# Altium project The_Robot.PrjPcb (part 2 of 2)

## Sheet Microcontroller.SchDoc
size A4; SheetNumber: 4; SheetTotal: 6
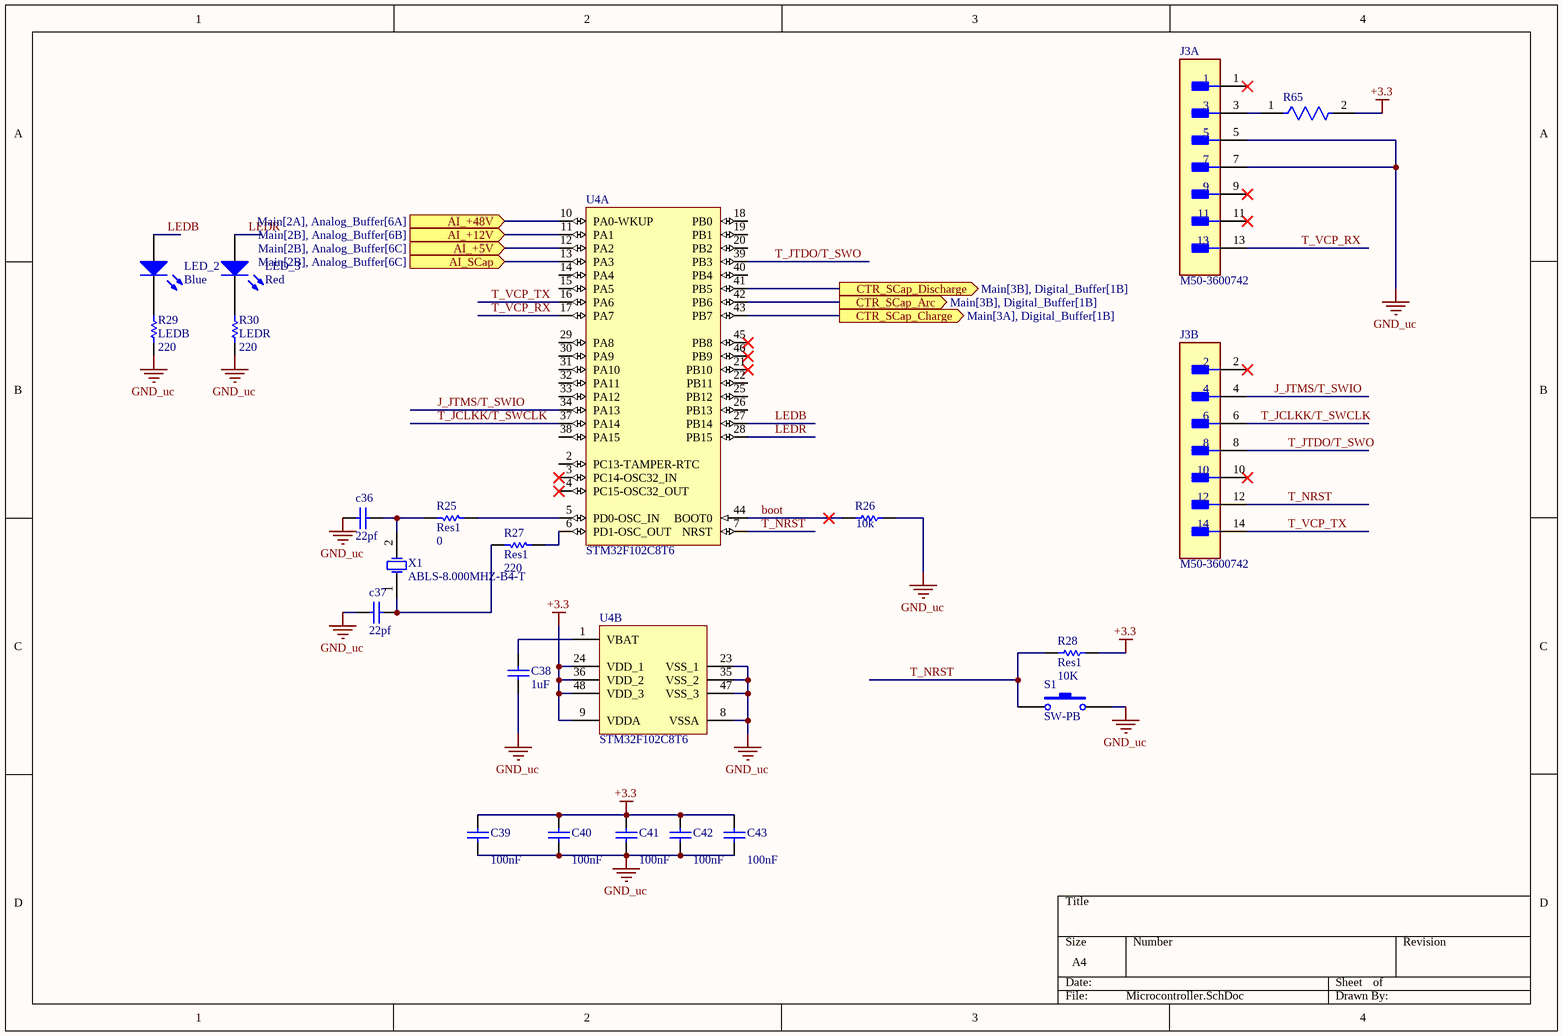
[diagram p3: Microcontroller.SchDoc]

### Parts
c36  22pf  [0805C]
c37  22pf  [0805C]
C38  1uF  [0805C]
C39  value 100nF  [0805C]
C40  value 100nF  [0805C]
C41  value 100nF  [0805C]
C42  value 100nF  [0805C]
C43  value 100nF  [0805C]
J3  M50-3600742  [FP-M50-3600742-MFG]  (parts A,B of 2)
LED_2  Blue  [0805LED]
LED_3  Red  [0805LED]
R25  Res1  value 0  [0805L]
R26  value 10k  [0805L]  (hidden comment: Res1)
R27  Res1  value 220  [0805L]
R28  Res1  value 10K  [0805L]
R29  LEDB  value 220  [0805L]
R30  LEDR  value 220  [0805L]
R65  RC1206JR-070RL  [FP-RC1206-MFG]  (value not drawn)
S1  SW-PB  [sw-pb-4p]
U4  STM32F102C8T6  [STM-LQFP48_N]  (parts A,B of 2)
X1  ABLS-8.000MHZ-B4-T  [ABRA-ABLS-14.7456MHZ-B2-T_V]

### Ports
AI_+5V (in, see Main[2B], Analog_Buffer[6C]), AI_+12V (in, see Main[2B], Analog_Buffer[6B]), AI_+48V (in, see Main[2A], Analog_Buffer[6A]), AI_SCap (in, see Main[2B], Analog_Buffer[6C]), CTR_SCap_Arc (out, see Main[3B], Digital_Buffer[1B]), CTR_SCap_Charge (out, see Main[3A], Digital_Buffer[1B]), CTR_SCap_Discharge (out, see Main[3B], Digital_Buffer[1B])

### Nets
+3.3: C39.2 C40.2 C41.2 C42.2 C43.2 R28.1 R65.2 U4.9(VDDA) U4.24(VDD_1) U4.36(VDD_2) U4.48(VDD_3)
GND_uc: c36.2 c37.2 C38.1 C39.1 C40.1 C41.1 C42.1 C43.1 J3.5 J3.7 R26.2 R29.2 R30.1 S1.2 U4.8(VSSA) U4.23(VSS_1) U4.35(VSS_2) U4.47(VSS_3)
AI_+5V: U4.12(PA2) ; port AI_+5V
AI_+12V: U4.11(PA1) ; port AI_+12V
AI_+48V: U4.10(PA0-WKUP) ; port AI_+48V
AI_SCap: U4.13(PA3) ; port AI_SCap
boot: R26.1 U4.44(BOOT0)
CTR_SCap_Arc: U4.42(PB6) ; port CTR_SCap_Arc
CTR_SCap_Charge: U4.43(PB7) ; port CTR_SCap_Charge
CTR_SCap_Discharge: U4.41(PB5) ; port CTR_SCap_Discharge
J_JTMS/T_SWIO: J3.4 U4.34(PA13)
LEDB: LED_2.1(A) U4.27(PB14)
LEDR: LED_3.1(A) U4.28(PB15)
T_JCLKK/T_SWCLK: J3.6 U4.37(PA14)
T_JTDO/T_SWO: J3.8 U4.39(PB3)
T_NRST: J3.12 R28.2 S1.1 U4.7(NRST)
T_VCP_RX: J3.13 U4.17(PA7)
T_VCP_TX: J3.14 U4.16(PA6)
Netc36_1: c36.1 R25.2 X1.2(X2)
Netc37_1: c37.1 R27.1 X1.1(X1)
NetC38_2: C38.2 U4.1(VBAT)
NetJ3_3: J3.3 R65.1
NetLED_2_2: LED_2.2(K) R29.1
NetLED_3_2: LED_3.2(K) R30.2
NetR25_1: R25.1 U4.5(PD0-OSC_IN)
NetR27_2: R27.2 U4.6(PD1-OSC_OUT)

Not connected (* = marked no-connect by the designer): J3 1* 2* 9* 10* 11*; U4 2(PC13-TAMPER-RTC) 3(PC14-OSC32_IN)* 4(PC15-OSC32_OUT)* 14(PA4) 15(PA5) 18(PB0) 19(PB1) 20(PB2) 21(PB10)* 22(PB11) 25(PB12) 26(PB13) 29(PA8) 30(PA9) 31(PA10) 32(PA11) 33(PA12) 38(PA15) 40(PB4) 45(PB8)* 46(PB9)*

### Library data of the parts
c36 c37 C38 = Cap_UP: Capacitor; Published: 8-Jun-2000; LatestRevisionDate: 17-Jul-2002; LatestRevisionNote: Re-released for DXP Platform.; PackageReference: RAD-0.3; Publisher: Altium Limited
  c36 c37: Value: 22pf
  C38: Value: 1uF
C39-C43 = Cap: Capacitor; Manufacturer: Generic Components; Class: Passive; Published: 08/06/2000; Publisher: Altium Hobart Technology Centre; SubClass: Capacitor
J3 = CMP-15831-000067-1: CONN HEADER SMD 14POS 1.27MM; Row Spacing: 0.05inch; Number of Contacts: 14; Contact Resistance: 30mR; Gender: Male; Max Current Rating: 1A; Radiation Hardening: No; Series: Archer M50; Package Quantity: 500; Length: 8.89mm; Orientation: Straight; Number of Positions: 14; Termination: Solder; Housing Material: Thermoplastic; Depth: 3.41mm; Pitch: 1.27mm; Packaging: Bulk; Contact Plating: Gold; Contact Mating Length: 0.118inch; Max Operating Temperature: 105°C; Number of Rows: 2; Min Operating Temperature: -40°C; Color: Black; Mount: Surface Mount; Contact Material: Copper Alloy
LED_2 LED_3 = LED3: Typical BLUE SiC LED; Published: 8-Jun-2000; LatestRevisionDate: 17-Dec-2003; LatestRevisionNote: PCB Footprint replaced.; DatasheetDocument: 16-Apr-2002; PackageDocument: 16-Apr-2002; PackageReference: 3.5X2.8X1.9; Publisher: Altium Limited
R25-R30 = Res1: Resistor; Published: 8-Jun-2000; LatestRevisionDate: 17-Jul-2002; LatestRevisionNote: Re-released for DXP Platform.; PackageReference: AXIAL-0.3; Publisher: Altium Limited
R65 = CMP-2100-03681-2: RES SMD 0 OHM JUMPER 1/4W 1206; Manufacturer: YAGEO; Voltage Rating: 200V; Temperature Coefficient: 300ppm/°C; Power Rating: 0.25W; Value: 0Ω; Tolerance: 5%; Manufacturer Part Number: RC1206JR-070RL; Temperature Range Low: -55°C; Category: Res; Automotive: No; Ipc Land Pattern Name: RESC310160X55; Device Class L1: Passive Components; Temperature: -55°C to +155°C; ComponentLink2URL: https://www.yageo.com/upload/media/product/productsearch/datasheet/rchip/PYu-RC_Group_51_RoHS_L_10.pdf; Lead Free: Yes; Height: 0.65mm; Footprint Url: https://www.yageo.com/upload/website/yageo_PYu-R_Mount_10_19050818_343.pdf; Package: RC1206; Digikey Description: RES SMD 0 OHM JUMPER 1/4W 1206; Temperature Range High: +155°C; Device Class L3: Chip SMD Resistors; Device Class L2: Resistors; Octopart: https://octopart.com/rc1206jr-070rl-yageo-40025601; Resistance: 0Ω; Series: RC; ComponentLink2Description: Datasheet; Composition: Thick Film; RoHS: TRUE; Mouser Description: Resistor: thick film; SMD; 1206; 0O; 0.25W; ±5%; -55÷155°C
S1 = SW-PB: Switch; Published: 24-Mar-1999; LatestRevisionDate: 17-Jul-2002; LatestRevisionNote: Re-released for DXP Platform.; PackageReference: SPST-2; Publisher: Altium Limited
U4 = STM32F102C8T6: ARM Cortex-M3 32-bit MCU, 64 KB Flash, 10 KB Internal RAM, 37 I/Os, 48-pin LQFP, -40 to 85 degC, Tray; A/D Converter: 1x12-bit (10 Channel); FLASH Size (Prog) (kB): 64; I/Os (High Current): 37; Internal RAM Size (kB): 10; Operating Frequency(F) (Processor speed) (MHz): 48; Supply Voltage(Vcc) min (V): 2; DatasheetVersion: Rev. 5; PackageVersion: Rev. 6, 06/2013; PackageReference: LQFP48; PackageDescription: 48-Pin Low Profile Quad Flat Package, 7 x 7 mm Body, 0.5 mm Pitch; Supplier 1: Digi-Key; Supplier Part Number 1: 497-8307-ND; Supplier 2: Farnell; Supplier Part Number 2: 2333153; Supplier 3: Newark; Supplier Part Number 3: 99W9777; Supplier 4: Mouser; Supplier Part Number 4: 511-STM32F102C8T6; Core: ARM Cortex-M3; Packing: Tray; Mounting Technology: Surface Mount; PartNumber: STM32F102C8T6; ComponentLink1Description: Manufacturer URL; ComponentLink1URL: http://www.st.com/web/en/home.html; ComponentLink2Description: Datasheet; ComponentLink2URL: http://www.st.com/st-web-ui/static/active/en/resource/technical/document/datasheet/CD00210831.pdf; ComponentLink3Description: Package Specification; ComponentLink3URL: http://www.st.com/st-web-ui/static/active/en/resource/technical/document/datasheet/DM00058181.pdf
X1 = CMP-2000-05726-1: Low Profile Crystal, 8.0 MHz, +/- 30 ppm, -20 to 70 degC, 2-Pin SMD, RoHS, Tape and Reel; Brand: ABRACON; Case Length: 11.4mm; Frequency Stability: 50PPM; ESR: 80Ohms; Case Height: 4.2mm; Tolerance: 30PPM; Frequency: 8MHz; Case Width: 4.7mm; Load Capacitance: 18pF; Datasheet Version: 04/2011; Termination Style: SMD/SMT; Dimensions: 4.7mmWx11.4mmLx4.2mmH; Packaging: Reel; Manufacturer: ABRACON; Package URL: http://www.abracon.com/Support/PackageDrawing/Resonators/ABLS-2D.pdf; Mounting Technology: SurfaceMount; Package Reference: ABLS-14.7456MHZ-B2-T; Product Category: Crystals; Package Description: 2-Pin Surface Mount Device, Body 11.4 x 4.7 mm; Package / Case: HC-49/US; Mounting Style: SMD/SMT; Operating Temperature Range: -20Cto+70C; Series: ABLS; Factory Pack Quantity: 1000; Datasheet URL: http://www.abracon.com/Resonators/abls.pdf; Manufacturer URL: http://www.abracon.com/; RoHS: Details; Type: LowProfileMicroprocessorCrystal

## Sheet Digital_Buffer.SchDoc
size A4; SheetNumber: 5; SheetTotal: 6
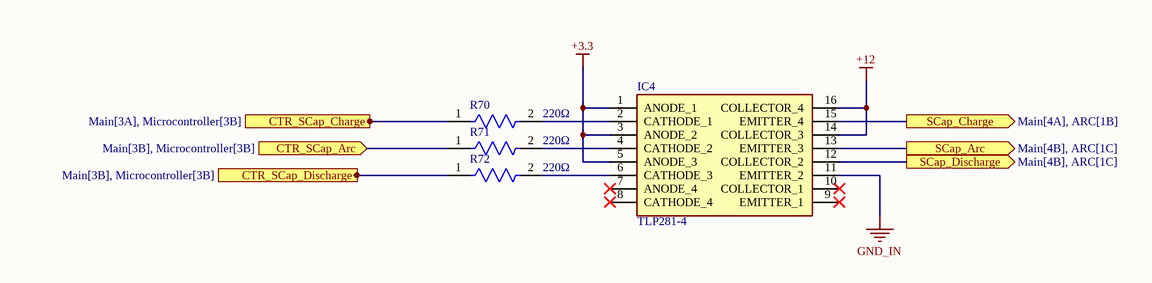
[diagram p4: Digital_Buffer.SchDoc]

### Parts
IC4  TLP281-4  [SOIC127P700X210-16N]
R70  value 220Ω  [FP-RT1206-MFG]  (hidden comment: RT1206FRE07220RL)
R71  value 220Ω  [FP-RT1206-MFG]  (hidden comment: RT1206FRE07220RL)
R72  value 220Ω  [FP-RT1206-MFG]  (hidden comment: RT1206FRE07220RL)

### Ports
CTR_SCap_Arc (in, see Main[3B], Microcontroller[3B]), CTR_SCap_Charge (in, see Main[3A], Microcontroller[3B]), CTR_SCap_Discharge (in, see Main[3B], Microcontroller[3B]), SCap_Arc (out, see Main[4B], ARC[1C]), SCap_Charge (out, see Main[4A], ARC[1B]), SCap_Discharge (out, see Main[4B], ARC[1C])

### Nets
+3.3: IC4.1(ANODE_1) IC4.3(ANODE_2) IC4.5(ANODE_3)
+12: IC4.14(COLLECTOR_3) IC4.16(COLLECTOR_4)
GND_IN: IC4.11(EMITTER_2)
CTR_SCap_Arc: R71.1 ; port CTR_SCap_Arc
CTR_SCap_Charge: R70.1 ; port CTR_SCap_Charge
CTR_SCap_Discharge: R72.1 ; port CTR_SCap_Discharge
SCap_Arc: IC4.13(EMITTER_3) ; port SCap_Arc
SCap_Charge: IC4.15(EMITTER_4) ; port SCap_Charge
SCap_Discharge: IC4.12(COLLECTOR_2) ; port SCap_Discharge
NetIC4_2: IC4.2(CATHODE_1) R70.2
NetIC4_4: IC4.4(CATHODE_2) R71.2
NetIC4_6: IC4.6(CATHODE_3) R72.2

Not connected (* = marked no-connect by the designer): IC4 7(ANODE_4)* 8(CATHODE_4)* 9(EMITTER_1)* 10(COLLECTOR_1)*

### Library data of the parts
IC4 = TLP281-4: Integrated Circuit; Manufacturer_Name: Toshiba; Datasheet Link: https://www.datasheet5.com/part/TLP281-4/Toshiba%20America%20Electronic%20Components/ecad-model; Height: 2.1mm; Manufacturer_Part_Number: TLP281-4; Mouser Part Number: 757-TLP281-4; Mouser Price/Stock: https://www.mouser.co.uk/ProductDetail/Toshiba/TLP281-4?qs=nul2o59pkPL9bOIg9yeNdw%3D%3D
R70-R72 = CMP-03412-012208-1: RES SMD 220 OHM 1% 1/4W 1206; Manufacturer: Yageo; Power Rating: 0.25W; Tolerance: 0.0002; Temperature Coefficient: 50 ppm/°C; Voltage Rating: 200V; RoHS: TRUE; Device Class L2: Resistors; Composition: Thin Film; Mouser Description: Res Thin Film 1206 220 Ohm 1% 0.25W(1/4W) ±50ppm/C Epoxy Pad SMD T/R; Manufacturer Part Number: RT1206FRE07220RL; Package: RT1206; Automotive: No; Category: Res; Temperature Range High: +155°C; Temperature Range Low: -55°C; Footprint Url: http://www.yageo.com/exep/pages/download/literatures/PYu-R_Mount_10.pdf; Series: RT; Height: 0.65mm; Digikey Description: RES SMD 220 OHM 1% 1/4W 1206; Temperature: -55°C to +155°C; Lead Free: Yes; ComponentLink2Description: Datasheet; Device Class L1: Passive Components; Device Class L3: Chip SMD Resistors; ComponentLink2URL: http://www.yageo.com/documents/recent/PYu-RT_1-to-0.01_RoHS_L_9.pdf; Ipc Land Pattern Name: RESC310160X55; Resistance: 220Ω; Octopart: https://octopart.com/rt1206fre07220rl-yageo-1236006

## Sheet Analog_Buffer.SchDoc
size A2; SheetNumber: 6; SheetTotal: 6
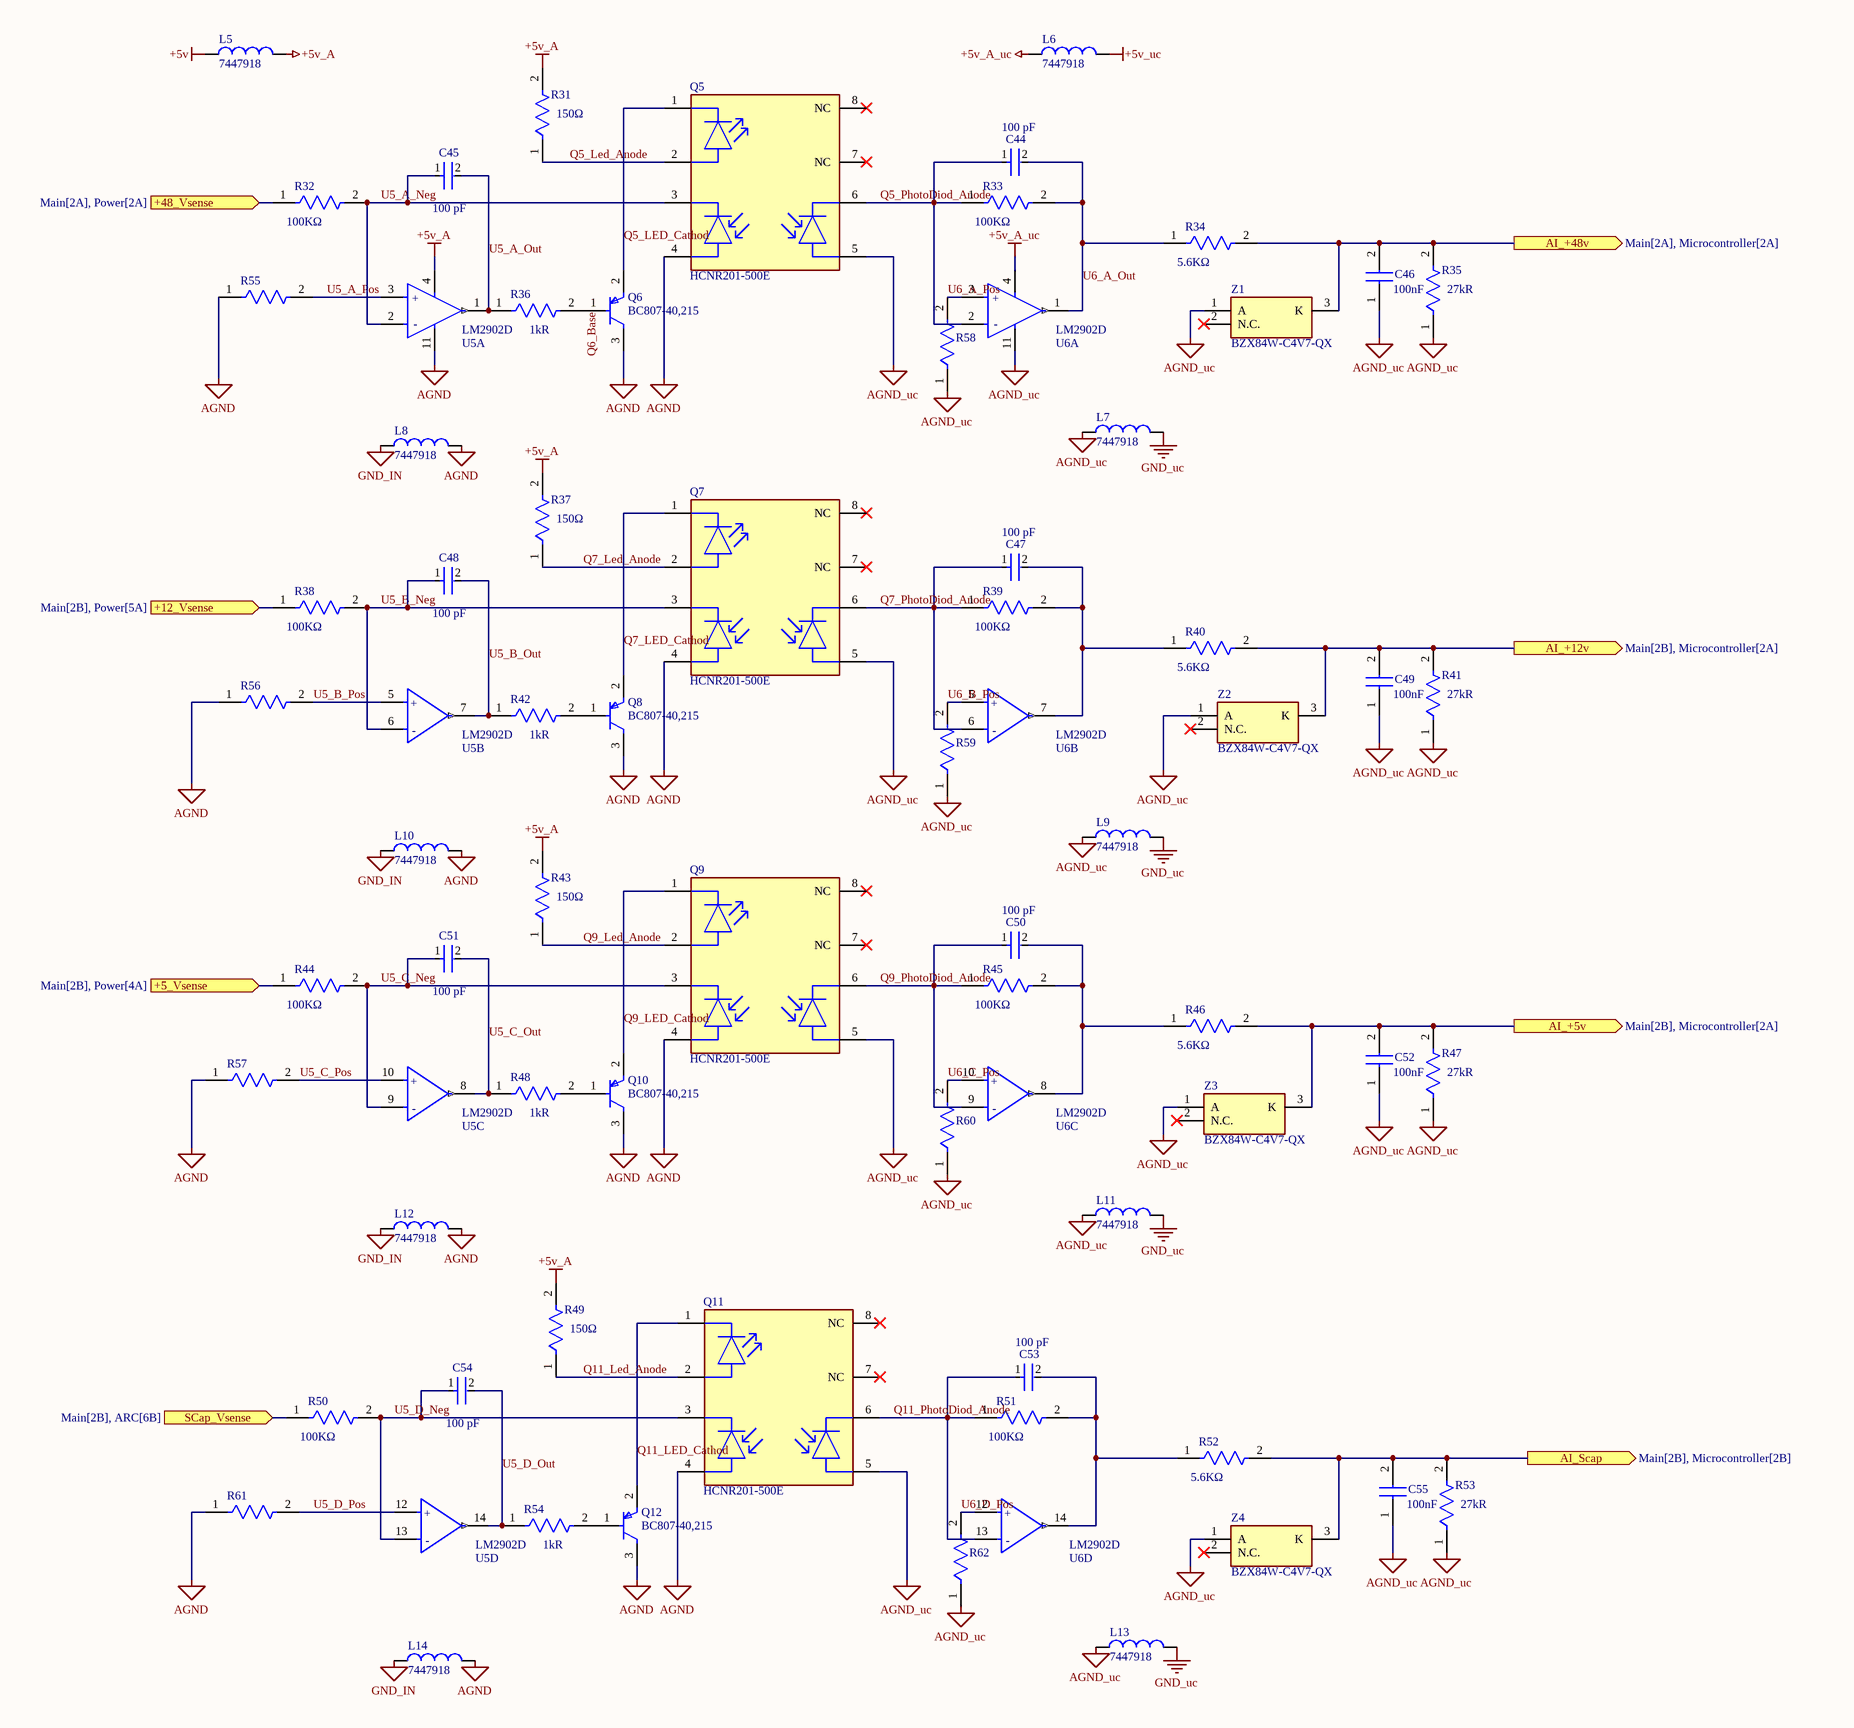
[diagram p5: Analog_Buffer.SchDoc]

### Parts
C44  value 100 pF  [FP-C1206C-EB-MFG]  (hidden comment: C1206C101K5GACTU)
C45  value 100 pF  [FP-C1206C-EB-MFG]  (hidden comment: C1206C101K5GACTU)
C46  100nF  [CAPC3216X95N]
C47  value 100 pF  [FP-C1206C-EB-MFG]  (hidden comment: C1206C101K5GACTU)
C48  value 100 pF  [FP-C1206C-EB-MFG]  (hidden comment: C1206C101K5GACTU)
C49  100nF  [CAPC3216X95N]
C50  value 100 pF  [FP-C1206C-EB-MFG]  (hidden comment: C1206C101K5GACTU)
C51  value 100 pF  [FP-C1206C-EB-MFG]  (hidden comment: C1206C101K5GACTU)
C52  100nF  [CAPC3216X95N]
C53  value 100 pF  [FP-C1206C-EB-MFG]  (hidden comment: C1206C101K5GACTU)
C54  value 100 pF  [FP-C1206C-EB-MFG]  (hidden comment: C1206C101K5GACTU)
C55  100nF  [CAPC3216X95N]
L5  7447918  [WE-MI_1206_L3.2W1.6H1.1]
L6  7447918  [WE-MI_1206_L3.2W1.6H1.1]
L7  7447918  [WE-MI_1206_L3.2W1.6H1.1]
L8  7447918  [WE-MI_1206_L3.2W1.6H1.1]
L9  7447918  [WE-MI_1206_L3.2W1.6H1.1]
L10  7447918  [WE-MI_1206_L3.2W1.6H1.1]
L11  7447918  [WE-MI_1206_L3.2W1.6H1.1]
L12  7447918  [WE-MI_1206_L3.2W1.6H1.1]
L13  7447918  [WE-MI_1206_L3.2W1.6H1.1]
L14  7447918  [WE-MI_1206_L3.2W1.6H1.1]
Q5  HCNR201-500E  [FP-HCNR201-500E-MFG]
Q6  BC807-40,215  [FP-SOT23-IPC_B]
Q7  HCNR201-500E  [FP-HCNR201-500E-MFG]
Q8  BC807-40,215  [FP-SOT23-IPC_B]
Q9  HCNR201-500E  [FP-HCNR201-500E-MFG]
Q10  BC807-40,215  [FP-SOT23-IPC_B]
Q11  HCNR201-500E  [FP-HCNR201-500E-MFG]
Q12  BC807-40,215  [FP-SOT23-IPC_B]
R31  Resistance: 150Ω  [FP-RP732B-MFG]  (hidden comment: RP73D2B150RBTG)
R32  value 100KΩ  [FP-RT1206-MFG]  (hidden comment: RT1206DRE07100KL)
R33  value 100KΩ  [FP-RT1206-MFG]  (hidden comment: RT1206DRE07100KL)
R34  value 5.6KΩ  [FP-CRGP1206-IPC_C]  (hidden comment: CRGP1206F5K6)
R35  Resistance: 27kR  [FP-RC3216-IPC_A]  (hidden comment: RC3216J273CS)
R36  Resistance: 1kR  [FP-CR1206-IPC_A]  (hidden comment: CR1206-FX-1001ELF)
R37  Resistance: 150Ω  [FP-RP732B-MFG]  (hidden comment: RP73D2B150RBTG)
R38  value 100KΩ  [FP-RT1206-MFG]  (hidden comment: RT1206DRE07100KL)
R39  value 100KΩ  [FP-RT1206-MFG]  (hidden comment: RT1206DRE07100KL)
R40  value 5.6KΩ  [FP-CRGP1206-IPC_C]  (hidden comment: CRGP1206F5K6)
R41  Resistance: 27kR  [FP-RC3216-IPC_A]  (hidden comment: RC3216J273CS)
R42  Resistance: 1kR  [FP-CR1206-IPC_A]  (hidden comment: CR1206-FX-1001ELF)
R43  Resistance: 150Ω  [FP-RP732B-MFG]  (hidden comment: RP73D2B150RBTG)
R44  value 100KΩ  [FP-RT1206-MFG]  (hidden comment: RT1206DRE07100KL)
R45  value 100KΩ  [FP-RT1206-MFG]  (hidden comment: RT1206DRE07100KL)
R46  value 5.6KΩ  [FP-CRGP1206-IPC_C]  (hidden comment: CRGP1206F5K6)
R47  Resistance: 27kR  [FP-RC3216-IPC_A]  (hidden comment: RC3216J273CS)
R48  Resistance: 1kR  [FP-CR1206-IPC_A]  (hidden comment: CR1206-FX-1001ELF)
R49  Resistance: 150Ω  [FP-RP732B-MFG]  (hidden comment: RP73D2B150RBTG)
R50  value 100KΩ  [FP-RT1206-MFG]  (hidden comment: RT1206DRE07100KL)
R51  value 100KΩ  [FP-RT1206-MFG]  (hidden comment: RT1206DRE07100KL)
R52  value 5.6KΩ  [FP-CRGP1206-IPC_C]  (hidden comment: CRGP1206F5K6)
R53  Resistance: 27kR  [FP-RC3216-IPC_A]  (hidden comment: RC3216J273CS)
R54  Resistance: 1kR  [FP-CR1206-IPC_A]  (hidden comment: CR1206-FX-1001ELF)
R55  RC1206JR-070RL  [FP-RC1206-MFG]  (value not drawn)
R56  RC1206JR-070RL  [FP-RC1206-MFG]  (value not drawn)
R57  RC1206JR-070RL  [FP-RC1206-MFG]  (value not drawn)
R58  RC1206JR-070RL  [FP-RC1206-MFG]  (value not drawn)
R59  RC1206JR-070RL  [FP-RC1206-MFG]  (value not drawn)
R60  RC1206JR-070RL  [FP-RC1206-MFG]  (value not drawn)
R61  RC1206JR-070RL  [FP-RC1206-MFG]  (value not drawn)
R62  RC1206JR-070RL  [FP-RC1206-MFG]  (value not drawn)
U5  LM2902D  [FP-D0014A-MFG]  (parts A,B,C,D of 4)
U6  LM2902D  [FP-D0014A-MFG]  (parts A,B,C,D of 4)
Z1  BZX84W-C4V7-QX  [SOT65P210X110-3N]
Z2  BZX84W-C4V7-QX  [SOT65P210X110-3N]
Z3  BZX84W-C4V7-QX  [SOT65P210X110-3N]
Z4  BZX84W-C4V7-QX  [SOT65P210X110-3N]

### Ports
+5_Vsense (in, see Main[2B], Power[4A]), +12_Vsense (in, see Main[2B], Power[5A]), +48_Vsense (in, see Main[2A], Power[2A]), AI_+5v (out, see Main[2B], Microcontroller[2A]), AI_+12v (out, see Main[2B], Microcontroller[2A]), AI_+48v (out, see Main[2A], Microcontroller[2A]), AI_Scap (out, see Main[2B], Microcontroller[2B]), SCap_Vsense (in, see Main[2B], ARC[6B])

### Nets
+5v: L5.1
+5v_A: L5.2 R31.2 R37.2 R43.2 R49.2 U5.4(VCC)
+5v_A_uc: L6.1 U6.4(VCC)
+5v_uc: L6.2
AGND: L8.2 L10.2 L12.2 L14.2 Q5.4(PD1_ANODE) Q6.3(C) Q7.4(PD1_ANODE) Q8.3(C) Q9.4(PD1_ANODE) Q10.3(C) Q11.4(PD1_ANODE) Q12.3(C) R55.1 R56.1 R57.1 R61.1 U5.11(GND)
AGND_uc: C46.1 C49.1 C52.1 C55.1 L7.1 L9.1 L11.1 L13.1 Q5.5(PD2_ANODE) Q7.5(PD2_ANODE) Q9.5(PD2_ANODE) Q11.5(PD2_ANODE) R35.1 R41.1 R47.1 R53.1 R58.1 R59.1 R60.1 R62.1 U6.11(GND) Z1.1(A) Z2.1(A) Z3.1(A) Z4.1(A)
GND_IN: L8.1 L10.1 L12.1 L14.1
GND_uc: L7.2 L9.2 L11.2 L13.2
+5_Vsense: R44.1 ; port +5_Vsense
+12_Vsense: R38.1 ; port +12_Vsense
+48_Vsense: R32.1 ; port +48_Vsense
AI_+5v: C52.2 R46.2 R47.2 Z3.3(K) ; port AI_+5v
AI_+12v: C49.2 R40.2 R41.2 Z2.3(K) ; port AI_+12v
AI_+48v: C46.2 R34.2 R35.2 Z1.3(K) ; port AI_+48v
AI_Scap: C55.2 R52.2 R53.2 Z4.3(K) ; port AI_Scap
Q5_Led_Anode: Q5.2(LED_ANODE) R31.1
Q5_LED_Cathod: Q5.1(LED_CATHODE) Q6.2(E)
Q5_PhotoDiod_Anode: C44.1 Q5.6(PD2_CATHODE) R33.1 U6.2(1IN-)
Q6_Base: Q6.1(B) R36.2
Q7_Led_Anode: Q7.2(LED_ANODE) R37.1
Q7_LED_Cathod: Q7.1(LED_CATHODE) Q8.2(E)
Q7_PhotoDiod_Anode: C47.1 Q7.6(PD2_CATHODE) R39.1 U6.6(2IN-)
Q9_Led_Anode: Q9.2(LED_ANODE) R43.1
Q9_LED_Cathod: Q9.1(LED_CATHODE) Q10.2(E)
Q9_PhotoDiod_Anode: C50.1 Q9.6(PD2_CATHODE) R45.1 U6.9(3IN-)
Q11_Led_Anode: Q11.2(LED_ANODE) R49.1
Q11_LED_Cathod: Q11.1(LED_CATHODE) Q12.2(E)
Q11_PhotoDiod_Anode: C53.1 Q11.6(PD2_CATHODE) R51.1 U6.13(4IN-)
SCap_Vsense: R50.1 ; port SCap_Vsense
U5_A_Neg: C45.1 Q5.3(PD1_CATHODE) R32.2 U5.2(1IN-)
U5_A_Out: C45.2 R36.1 U5.1(1OUT)
U5_A_Pos: R55.2 U5.3(1IN+)
U5_B_Neg: C48.1 Q7.3(PD1_CATHODE) R38.2 U5.6(2IN-)
U5_B_Out: C48.2 R42.1 U5.7(2OUT)
U5_B_Pos: R56.2 U5.5(2IN+)
U5_C_Neg: C51.1 Q9.3(PD1_CATHODE) R44.2 U5.9(3IN-)
U5_C_Out: C51.2 R48.1 U5.8(3OUT)
U5_C_Pos: R57.2 U5.10(3IN+)
U5_D_Neg: C54.1 Q11.3(PD1_CATHODE) R50.2 U5.13(4IN-)
U5_D_Out: C54.2 R54.1 U5.14(4OUT)
U5_D_Pos: R61.2 U5.12(4IN+)
U6_A_Out: C44.2 R33.2 R34.1 U6.1(1OUT)
U6_A_Pos: R58.2 U6.3(1IN+)
U6_B_Pos: R59.2 U6.5(2IN+)
U6_C_Pos: R60.2 U6.10(3IN+)
U6_D_Pos: R62.2 U6.12(4IN+)
NetC47_2: C47.2 R39.2 R40.1 U6.7(2OUT)
NetC50_2: C50.2 R45.2 R46.1 U6.8(3OUT)
NetC53_2: C53.2 R51.2 R52.1 U6.14(4OUT)
NetQ8_1: Q8.1(B) R42.2
NetQ10_1: Q10.1(B) R48.2
NetQ12_1: Q12.1(B) R54.2

Not connected (* = marked no-connect by the designer): Q5 7(NC)* 8(NC)*; Q7 7(NC)* 8(NC)*; Q9 7(NC)* 8(NC)*; Q11 7(NC)* 8(NC)*; Z1 2(N.C.)*; Z2 2(N.C.)*; Z3 2(N.C.)*; Z4 2(N.C.)*

### Notes on the sheet
- (in symbol CMP-04895-000277-1, part A) +; -
- (in symbol CMP-04895-000277-1, part B) +; -
- (in symbol CMP-04895-000277-1, part C) +; -
- (in symbol CMP-04895-000277-1, part D) +; -

### Library data of the parts
C44 C45 C47 C48 C50 C51 C53 C54 = CMP-03020-032313-1: CAP CER 100PF 50V 10% NP0 1206; Manufacturer: KEMET; Automotive Grade: Grade 0; Temperature Coefficient: 15%; Material: Ceramic; Tolerance: 0.1; Temperature Characteristic: C0G; Temperature: -55°C to +150°C; Automotive: Yes; Mouser Description: Multilayer Ceramic Capacitors MLCC - SMD/SMT 50volts 100pF C0G 10%; Ipc Land Pattern Name: CAPC320160X78; RoHS: TRUE; ComponentLink2URL: https://content.kemet.com/datasheets/KEM_C1007_X8R_ULTRA_150C_SMD.pdf; Height: 0.88mm; Lead Free: Yes; Octopart: https://octopart.com/c1206c101k5gactu-kemet-9138650; Manufacturer Part Number: C1206C101K5GACTU; Voltage Rating: 50 V; Temperature Range Low: -55°C; Digikey Description: CAP CER 100PF 50V 10% NP0 1206; Package: C1206C-EB; Capacitance: 100 pF; Device Class L2: Capacitors; Category: Cap; ComponentLink2Description: Datasheet; Device Class L3: Ceramic Capacitors; Device Class L1: Passive Components; Temperature Range High: +150°C
C46 C49 C52 C55 = GRM319F51H104ZA01D: Capacitor; Manufacturer_Name: Murata Electronics; Datasheet Link: http://www.murata.com/~/media/webrenewal/support/library/catalog/products/capacitor/mlcc/c02e.pdf; Height: 0.95mm; Manufacturer_Part_Number: GRM319F51H104ZA01D; Mouser Part Number: 81-GRM319F51H104ZA; Mouser Price/Stock: https://www.mouser.com/Search/Refine.aspx?Keyword=81-GRM319F51H104ZA; Arrow Part Number: GRM319F51H104ZA01D; Arrow Price/Stock: https://www.arrow.com/en/products/grm319f51h104za01d/murata-manufacturing
L5-L14 = CMP-0221-00030-2: NexarPartId: 23259292; Max DC Current: 25mA; Inductance Tolerance: 10%; Core Material: Ferrite; Inductance: 10µH; Shielding: Unshielded; DC Resistance (DCR): 500mΩ; Self Resonant Frequency: 26MHz; Ambient Temperature Range Low: -55°C; RoHS: Compliant; Tolerance: 10%; Length: 3.2mm; Width: 1.6mm; Case/Package: SMD/SMT; Min Operating Temperature: -55°C; Ambient Temperature Range High: 85°C; Depth: 1.6mm; Current Rating: 25mA; Max Operating Temperature: 125°C; Height: 1.1mm
Q5 Q7 Q9 Q11 = CMP-18400-000025-2: OPTOISO 5KV LINEAR PHVOLT 8DIPGW; Number of Channels: 1; Power Dissipation: 60mW; Forward Current: 25mA; Reverse Voltage (DC): 2.5V; Output Voltage: 15V; Current Transfer Ratio: 0.72%; Forward Voltage: 1.6V; Input Type: DC; Input Current: 20mA; Packaging: Tape and Reel; Number of Elements: 1; Mount: Surface Mount; Isolation Voltage-Max: 5kV; REACH SVHC: No SVHC; Package Quantity: 1; Radiation Hardening: No; Max Power Dissipation: 60mW; Max Input Current: 25mA; Lead Free: Lead Free; Series: -; Max Operating Temperature: 100°C; Isolation Voltage: 5kV; Number of Pins: 8; RoHS Compliant: Yes; Contact Plating: Tin; Min Operating Temperature: -55°C; Case/Package: SMD/SMT; Reverse Breakdown Voltage: 2.5V
Q6 Q8 Q10 Q12 = CMP-14406-000042-1: TRANS PNP 45V 500MA TO236AB; RoHS Compliant: Yes
R31 R37 R43 R49 = CMP-03211-001537-1: Res Thin Film 1206 150Ω 0.1% 0.25W 15ppm/°C Molded SMD; Manufacturer: TE Connectivity; Voltage Rating: 200V; RoHS: TRUE; Series: RP73; Height: 0.65mm; packaging: 250 cut tape length; Lead Free: Yes; octopart_url: https://octopart.com/rp73d2b150rbtg-te+connectivity-42011207; Category: Res; Manufacturer Part Number: RP73D2B150RBTG; Temperature Range High: 155°C; Composition: Thin Film; Tolerance: 0.1%; Device Class L2: Resistors; Automotive: No; ComponentLink2Description: Datasheet; Temperature Range Low: -55°C; Octopart: https://octopart.com/rp73d2b150rbtg-te+connectivity-42011207; Temperature: -55°C to 155°C; Temperature Coefficient: 15ppm/°C; ComponentLink2URL: https://www.te.com/commerce/DocumentDelivery/DDEController?Action=showdoc&DocId=Data+Sheet%7F1773272%7FL%7Fpdf%7FEnglish%7FENG_DS_1773272_L.pdf%7F8-1879255-6; Device Class L1: Passive Components; Value: 150Ω; Package: RP732B; Ipc Land Pattern Name: RESC305155X55; Power Rating: 0.25W; Device Class L3: Chip SMD Resistors
R32 R33 R38 R39 R44 R45 R50 R51 = CMP-2003-04271-2: RES SMD 100K OHM 0.5% 1/4W 1206; Manufacturer: Yageo; Power Rating: 0.25W; Tolerance: 0.0001; Temperature Coefficient: 50 ppm/°C; Voltage Rating: 200V; Mouser Description: Res Thin Film 1206 100K Ohm 0.5% 1/4W ±50ppm/°C Molded SMD Paper T/R; Series: RT; RoHS: TRUE; Device Class L3: Chip SMD Resistors; Ipc Land Pattern Name: RESC310160X55; Lead Free: Yes; Package: RT1206; Height: 0.65mm; Composition: Thin Film; Temperature Range Low: -55°C; Device Class L2: Resistors; Octopart: https://octopart.com/rt1206dre07100kl-yageo-1189867; ComponentLink2Description: Datasheet; ComponentLink2URL: http://www.yageo.com/documents/recent/PYu-RT_1-to-0.01_RoHS_L_9.pdf; Digikey Description: RES SMD 100K OHM 0.5% 1/4W 1206; Manufacturer Part Number: RT1206DRE07100KL; Temperature Range High: +155°C; Resistance: 100KΩ; Automotive: No; Temperature: -55°C to +155°C; Device Class L1: Passive Components; Footprint Url: http://www.yageo.com/exep/pages/download/literatures/PYu-R_Mount_10.pdf; Category: Res
R34 R40 R46 R52 = CMP-03211-000394-1: CRGP 1206 5K6 1%; Manufacturer: TE; Power Rating: 0.5W; Tolerance: 0.01; Voltage Rating: 200V; Temperature Coefficient: ±100ppm/°C; Device Class L1: Passive Components; Series: CRGP; Resistance: 5.6KΩ; Height: 0.65mm; RoHS: TRUE; Lead Free: Yes; Temperature Range High: +155°C; Device Class L3: Chip SMD Resistors; Automotive: No; Composition: Thick Film; ComponentLink2Description: Datasheet; Temperature Range Low: -55°C; Manufacturer Part Number: CRGP1206F5K6; Package: CRGP1206; Device Class L2: Resistors; Category: Res; ComponentLink2URL: https://www.mouser.com/datasheet/2/418/NG_DS_9-1773463-9_A-1358566.pdf; Digikey Description: CRGP 1206 5K6 1%; Ipc Land Pattern Name: RESC310155X55; Temperature: -55°C to +155°C; Ambient Temperature Range High: +70°C; Mouser Description: Res, Thick Film, 5K6, 1%, 0.5W, 1206; Octopart: https://octopart.com/crgp1206f5k6-te+connectivity-91018891
R35 R41 R47 R53 = CMP-13261-004377-1: Res Thick Film 1206 27kΩ 5% 0.25W ±100ppm/°C Molded SMD T/R; Voltage Rating (DC): 200V; Max Power Dissipation: 250mW; Height: 0.026inch; Case Code (Imperial): 1206; Contact Plating: Tin; Features: Moisture Resistant; Case Code (Metric): 3216; Length: 0.126inch; Case/Package: 1206; Packaging: Tape and Reel; Temperature Coefficient: 100ppm/°C; Number of Terminations: 2; Min Operating Temperature: -55°C; Tolerance: 5%; Radiation Hardening: No; Composition: Thick Film; Width: 0.063inch; Lead Free: Lead Free; Max Operating Temperature: 155°C
R36 R42 R48 R54 = CMP-07231-002641-1: Thick Film Chip Resistors 1206 1kΩ 0.25W 1% 100ppm/°C; Voltage Rating: 200V; Max Power Dissipation: 250mW; REACH SVHC: No SVHC; Radiation Hardening: No; Number of Terminations: 2; Max Operating Temperature: 155°C; Temperature Coefficient: 100ppm/°C; Voltage Rating (DC): 200V; Tolerance: 1%; Composition: Thick Film; Case Code (Imperial): 1206; Mount: Surface Mount; Width: 1.6mm; Min Operating Temperature: -55°C; Height: 0.6mm; Packaging: Tape and Reel; Number of Pins: 2; Package Quantity: 1; Military Standard: Not; Length: 3.2mm; Thickness: 610um; Case Code (Metric): 3216; Case/Package: 1206; Contact Plating: Tin; Power Rating: 250mW; Termination: SMD/SMT; Depth: 1.6mm; Features: Moisture Resistant
R55-R62 = CMP-2100-03681-2: as R65 on sheet Microcontroller; Manufacturer Part Number: RC1206JR-070RL; Temperature Range Low: -55°C; Category: Res; Automotive: No; Ipc Land Pattern Name: RESC310160X55; Device Class L1: Passive Components; Temperature: -55°C to +155°C; ComponentLink2URL: https://www.yageo.com/upload/media/product/productsearch/datasheet/rchip/PYu-RC_Group_51_RoHS_L_10.pdf; Lead Free: Yes; Height: 0.65mm; Footprint Url: https://www.yageo.com/upload/website/yageo_PYu-R_Mount_10_19050818_343.pdf; Package: RC1206; Digikey Description: RES SMD 0 OHM JUMPER 1/4W 1206; Temperature Range High: +155°C; Device Class L3: Chip SMD Resistors; Device Class L2: Resistors; Octopart: https://octopart.com/rc1206jr-070rl-yageo-40025601; Resistance: 0Ω; Series: RC; ComponentLink2Description: Datasheet; Composition: Thick Film; RoHS: TRUE; Mouser Description: Resistor: thick film; SMD; 1206; 0O; 0.25W; ±5%; -55÷155°C
U5 U6 = CMP-04895-000277-1: IC OPAMP GP 4 CIRCUIT 14SOIC; Gain Bandwidth Product: 1.2MHz; Input Bias Current: 250nA; Common Mode Rejection Ratio: 50dB; Number of Amplifiers: 4; Output Current per Channel: 60mA; Min Dual Supply Voltage: 1.5V; Nominal Supply Current: 3mA; Voltage Gain: 100dB; Dual Supply Voltage: 9V; Max Supply Voltage: 26V; Min Supply Voltage: 3V; Slew Rate: 0.5V/µs; Output Current: 30mA; Operating Supply Current: 1.4mA; Input Offset Voltage (Vos): 7mV; Operating Supply Voltage: 13V; Max Operating Temperature: 125°C; Height: 1.58mm; RoHS Compliant: Yes; Length: 8.65mm; Number of Channels: 4; Number of Pins: 14; Bandwidth: 1.2MHz; Width: 3.91mm; Case/Package: SOIC; Package Quantity: 50; Number of Circuits: 4; Unity Gain Bandwidth Product: 1.2MHz; Packaging: Rail/Tube; REACH SVHC: No SVHC; Min Operating Temperature: -40°C; Radiation Hardening: No; Mount: Surface Mount; Max Dual Supply Voltage: 13V; Lead Free: Lead Free; Number of Elements: 4
Z1-Z4 = BZX84W-C4V7-QX: Zener Diode; Manufacturer_Name: Nexperia; Datasheet Link: https://assets.nexperia.com/documents/data-sheet/BZX84W-Q_SER.pdf; Height: 1.1mm; Manufacturer_Part_Number: BZX84W-C4V7-QX

## Nets that join several sheets
+3.3: Power (FU1.2 R21.1), Microcontroller (11 pins), Digital_Buffer (IC4.1 IC4.3 IC4.5)
+5v: ARC (D1.2), Power (6 pins), Analog_Buffer (L5.1)
+5v_uc: Power (9 pins), Analog_Buffer (L6.2)
+12v: ARC (D7.2), Power (16 pins)
+12v_B: ARC (C4.1 IC2.8), Power (C22.1 PS2.7 R18.2)
+12v_D: ARC (IC1.4), Power (C21.1 PS3.7 R19.2)
+48v: ARC (F1.1), Power (D10.2 D16.2 J2.2 R63.1)
-12v_B: ARC (C4.2 IC2.5), Power (C23.1 PS2.5 R20.2)
AGND: ARC (C3.2 D1.1 R7.1), Analog_Buffer (17 pins)
GND_B: ARC (15 pins), Power (5 pins)
GND_D: ARC (7 pins), Power (PS3.5)
GND_IN: ARC (19 pins), Power (47 pins), Digital_Buffer (IC4.11), Analog_Buffer (L8.1 L10.1 L12.1 L14.1)
GND_uc: Power (10 pins), Microcontroller (18 pins), Analog_Buffer (L7.2 L9.2 L11.2 L13.2)